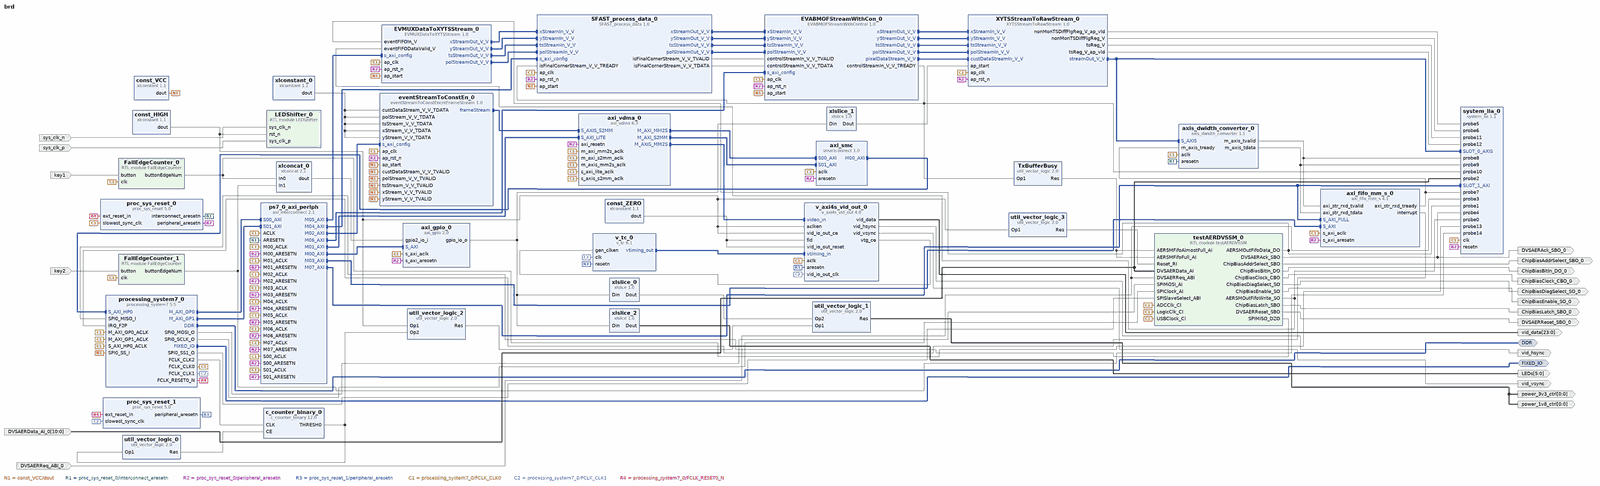
[diagram p0: block diagram of the top level, whole]
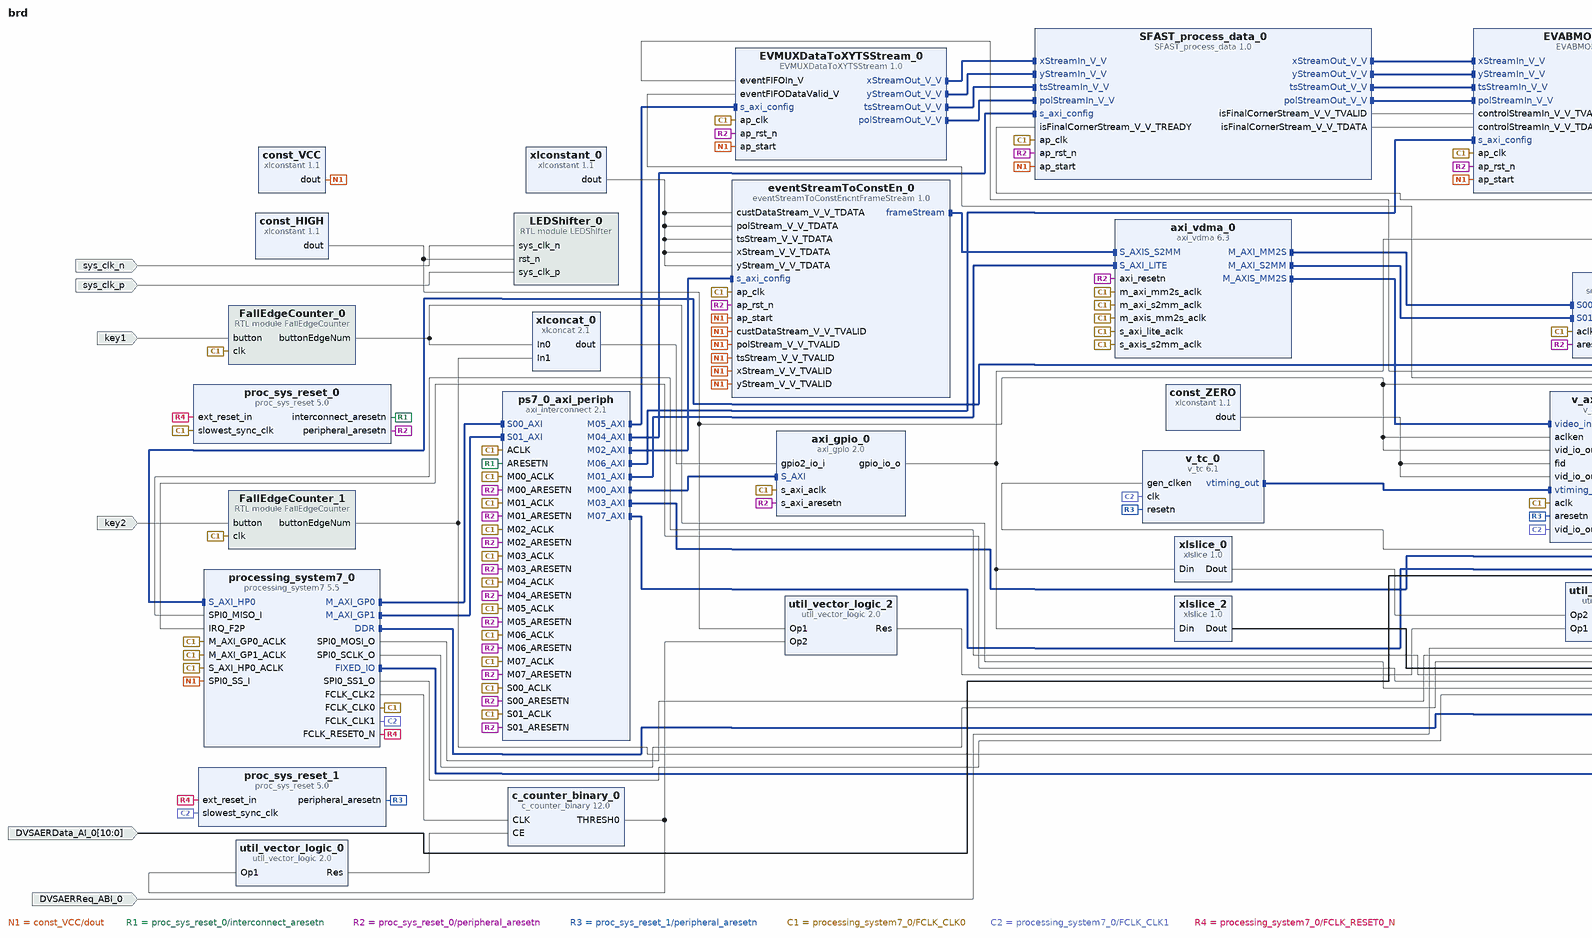
[diagram p1: block diagram of the top level, left part]
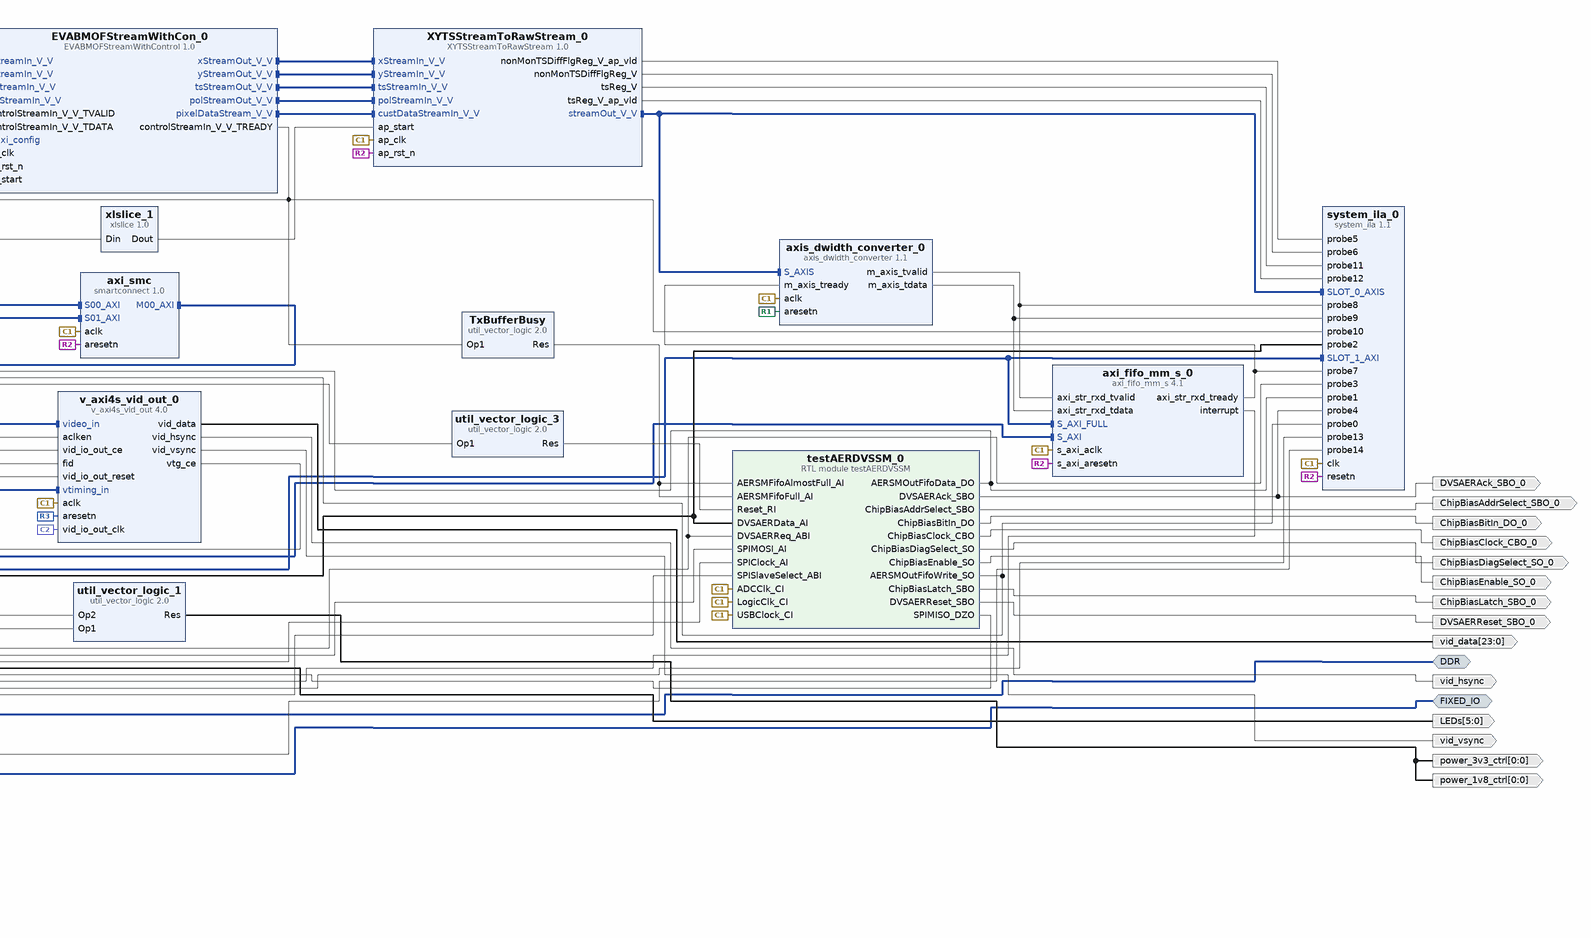
[diagram p2: block diagram of the top level, right part]
# Vivado block design brd, xc7z035ffg676-2, Vivado 2018.1
create_bd_design brd

create_bd_intf_port -mode Master -vlnv xilinx.com:interface:ddrx_rtl:1.0 DDR
create_bd_intf_port -mode Master -vlnv xilinx.com:display_processing_system7:fixedio_rtl:1.0 FIXED_IO
create_bd_port -dir I -from 10 -to 0 DVSAERData_AI_0
create_bd_port -dir I DVSAERReq_ABI_0
create_bd_port -dir O ChipBiasAddrSelect_SBO_0
create_bd_port -dir O ChipBiasBitIn_DO_0
create_bd_port -dir O ChipBiasClock_CBO_0
create_bd_port -dir O ChipBiasDiagSelect_SO_0
create_bd_port -dir O ChipBiasEnable_SO_0
create_bd_port -dir O ChipBiasLatch_SBO_0
create_bd_port -dir O DVSAERAck_SBO_0
create_bd_port -dir O DVSAERReset_SBO_0
create_bd_port -dir O -from 23 -to 0 vid_data
create_bd_port -dir O vid_hsync
create_bd_port -dir O vid_vsync
create_bd_port -dir I -type clk sys_clk_n
create_bd_port -dir I -type clk sys_clk_p
create_bd_port -dir O -from 5 -to 0 LEDs
create_bd_port -dir O -from 0 -to 0 power_3v3_ctrl
create_bd_port -dir O -from 0 -to 0 power_1v8_ctrl
create_bd_port -dir I key1
create_bd_port -dir I key2

create_bd_cell -type ip -vlnv xilinx.com:ip:axi_gpio:2.0 axi_gpio_0
set_property -dict [list \
  CONFIG.C_GPIO_WIDTH 32 \
  CONFIG.C_IS_DUAL 1 \
  CONFIG.C_DOUT_DEFAULT 0x0000000F \
  CONFIG.C_ALL_INPUTS_2 1 \
  CONFIG.C_INTERRUPT_PRESENT 0 \
  CONFIG.C_ALL_OUTPUTS 1 \
] [get_bd_cells axi_gpio_0]
create_bd_cell -type ip -vlnv xilinx.com:ip:smartconnect:1.0 axi_smc
set_property -dict {CONFIG.NUM_SI 2} [get_bd_cells axi_smc]
create_bd_cell -type ip -vlnv xilinx.com:ip:axi_vdma:6.3 axi_vdma_0
set_property -dict {CONFIG.c_m_axis_mm2s_tdata_width 24} [get_bd_cells axi_vdma_0]
create_bd_cell -type ip -vlnv xilinx.com:ip:xlconstant:1.1 const_HIGH
create_bd_cell -type ip -vlnv xilinx.com:ip:xlconstant:1.1 const_VCC
create_bd_cell -type ip -vlnv xilinx.com:ip:xlconstant:1.1 const_ZERO
set_property -dict {CONFIG.CONST_VAL 0} [get_bd_cells const_ZERO]
create_bd_cell -type ip -vlnv xilinx.com:ip:proc_sys_reset:5.0 proc_sys_reset_0
create_bd_cell -type ip -vlnv xilinx.com:ip:proc_sys_reset:5.0 proc_sys_reset_1
create_bd_cell -type ip -vlnv xilinx.com:ip:processing_system7:5.5 processing_system7_0
set_property -dict [list \
  CONFIG.PCW_FCLK_CLK1_BUF TRUE \
  CONFIG.PCW_FCLK_CLK2_BUF TRUE \
  CONFIG.PCW_FCLK_CLK3_BUF TRUE \
  CONFIG.PCW_UIPARAM_DDR_FREQ_MHZ 533.333333 \
  CONFIG.PCW_CPU_CPU_6X4X_MAX_RANGE 800 \
  CONFIG.PCW_CRYSTAL_PERIPHERAL_FREQMHZ 33.3333333 \
  CONFIG.PCW_APU_PERIPHERAL_FREQMHZ 666.666666 \
  CONFIG.PCW_UART_PERIPHERAL_FREQMHZ 100 \
  CONFIG.PCW_SPI_PERIPHERAL_FREQMHZ 125 \
  CONFIG.PCW_FPGA0_PERIPHERAL_FREQMHZ 100 \
  CONFIG.PCW_FPGA1_PERIPHERAL_FREQMHZ 40 \
  CONFIG.PCW_FPGA2_PERIPHERAL_FREQMHZ 10 \
  CONFIG.PCW_FPGA3_PERIPHERAL_FREQMHZ 125 \
  CONFIG.PCW_USE_M_AXI_GP1 1 \
  CONFIG.PCW_USE_S_AXI_HP0 1 \
  CONFIG.PCW_USE_FABRIC_INTERRUPT 1 \
  CONFIG.PCW_EN_CLK1_PORT 1 \
  CONFIG.PCW_EN_CLK2_PORT 1 \
  CONFIG.PCW_EN_CLK3_PORT 1 \
  CONFIG.PCW_IRQ_F2P_INTR 1 \
  CONFIG.PCW_PERIPHERAL_BOARD_PRESET None \
  CONFIG.PCW_PRESET_BANK1_VOLTAGE {LVCMOS 1.8V} \
  CONFIG.PCW_UIPARAM_DDR_PARTNO {MT41J256M16 RE-125} \
  CONFIG.PCW_QSPI_PERIPHERAL_ENABLE 1 \
  CONFIG.PCW_QSPI_QSPI_IO {MIO 1 .. 6} \
  CONFIG.PCW_QSPI_GRP_SINGLE_SS_ENABLE 0 \
  CONFIG.PCW_DUAL_PARALLEL_QSPI_DATA_MODE x8 \
  CONFIG.PCW_QSPI_GRP_IO1_ENABLE 1 \
  CONFIG.PCW_QSPI_GRP_IO1_IO {MIO 0 9 .. 13} \
  CONFIG.PCW_QSPI_GRP_FBCLK_ENABLE 1 \
  CONFIG.PCW_QSPI_GRP_FBCLK_IO {MIO 8} \
  CONFIG.PCW_QSPI_INTERNAL_HIGHADDRESS 0xFDFFFFFF \
  CONFIG.PCW_ENET0_PERIPHERAL_ENABLE 0 \
  CONFIG.PCW_SD0_PERIPHERAL_ENABLE 0 \
  CONFIG.PCW_UART0_PERIPHERAL_ENABLE 1 \
  CONFIG.PCW_UART0_UART0_IO {MIO 14 .. 15} \
  CONFIG.PCW_UART1_PERIPHERAL_ENABLE 0 \
  CONFIG.PCW_SPI0_PERIPHERAL_ENABLE 1 \
  CONFIG.PCW_SPI0_SPI0_IO EMIO \
  CONFIG.PCW_USB0_PERIPHERAL_ENABLE 1 \
  CONFIG.PCW_USB0_USB0_IO {MIO 28 .. 39} \
  CONFIG.PCW_GPIO_MIO_GPIO_ENABLE 0 \
  CONFIG.PCW_FPGA_FCLK1_ENABLE 1 \
  CONFIG.PCW_FPGA_FCLK2_ENABLE 1 \
  CONFIG.PCW_FPGA_FCLK3_ENABLE 1 \
] [get_bd_cells processing_system7_0]
# 417 more settings of processing_system7_0 are not shown: defaults, MIO pin electricals, DDR timing, and values the tool derives
create_bd_cell -type ip -vlnv xilinx.com:ip:axi_interconnect:2.1 ps7_0_axi_periph
set_property -dict {CONFIG.NUM_SI 2 CONFIG.NUM_MI 8} [get_bd_cells ps7_0_axi_periph]
create_bd_cell -type ip -vlnv xilinx.com:ip:system_ila:1.1 system_ila_0
set_property -dict [list \
  CONFIG.C_SLOT_6_TYPE 0 \
  CONFIG.C_SLOT_2_TYPE 0 \
  CONFIG.C_SLOT_1_TYPE 0 \
  CONFIG.C_SLOT_0_TYPE 0 \
  CONFIG.C_SLOT_0_APC_EN 0 \
  CONFIG.C_SLOT_1_APC_EN 0 \
  CONFIG.C_SLOT_2_APC_EN 0 \
  CONFIG.C_SLOT_3_APC_EN 0 \
  CONFIG.C_SLOT_4_APC_EN 0 \
  CONFIG.C_SLOT_5_APC_EN 0 \
  CONFIG.C_SLOT_6_APC_EN 0 \
  CONFIG.C_SLOT_7_APC_EN 0 \
  CONFIG.C_SLOT_2_AXI_AW_SEL_DATA 1 \
  CONFIG.C_SLOT_2_AXI_W_SEL_DATA 1 \
  CONFIG.C_SLOT_2_AXI_B_SEL_DATA 1 \
  CONFIG.C_SLOT_2_AXI_AR_SEL_DATA 1 \
  CONFIG.C_SLOT_2_AXI_R_SEL_DATA 1 \
  CONFIG.C_SLOT_2_AXI_AW_SEL_TRIG 1 \
  CONFIG.C_SLOT_2_AXI_W_SEL_TRIG 1 \
  CONFIG.C_SLOT_2_AXI_B_SEL_TRIG 1 \
  CONFIG.C_SLOT_2_AXI_AR_SEL_TRIG 1 \
  CONFIG.C_SLOT_2_AXI_R_SEL_TRIG 1 \
  CONFIG.C_SLOT_0_AXI_DATA_SEL 1 \
  CONFIG.C_SLOT_1_AXI_DATA_SEL 1 \
  CONFIG.C_SLOT_2_AXI_DATA_SEL 1 \
  CONFIG.C_SLOT_3_AXI_DATA_SEL 1 \
  CONFIG.C_SLOT_4_AXI_DATA_SEL 1 \
  CONFIG.C_SLOT_5_AXI_DATA_SEL 1 \
  CONFIG.C_SLOT_6_AXI_DATA_SEL 1 \
  CONFIG.C_SLOT_7_AXI_DATA_SEL 1 \
  CONFIG.C_SLOT_0_AXI_TRIG_SEL 1 \
  CONFIG.C_SLOT_1_AXI_TRIG_SEL 1 \
  CONFIG.C_SLOT_2_AXI_TRIG_SEL 1 \
  CONFIG.C_SLOT_3_AXI_TRIG_SEL 1 \
  CONFIG.C_SLOT_4_AXI_TRIG_SEL 1 \
  CONFIG.C_SLOT_5_AXI_TRIG_SEL 1 \
  CONFIG.C_SLOT_6_AXI_TRIG_SEL 1 \
  CONFIG.C_SLOT_7_AXI_TRIG_SEL 1 \
  CONFIG.C_PROBE22_TYPE 0 \
  CONFIG.C_PROBE21_TYPE 0 \
  CONFIG.C_PROBE20_TYPE 0 \
  CONFIG.C_PROBE19_TYPE 0 \
  CONFIG.C_PROBE18_TYPE 0 \
  CONFIG.C_PROBE17_TYPE 0 \
  CONFIG.C_PROBE16_TYPE 0 \
  CONFIG.C_PROBE15_TYPE 0 \
  CONFIG.C_PROBE14_TYPE 0 \
  CONFIG.C_PROBE13_TYPE 0 \
  CONFIG.C_PROBE12_TYPE 0 \
  CONFIG.C_PROBE11_TYPE 0 \
  CONFIG.C_PROBE10_TYPE 0 \
  CONFIG.C_PROBE9_TYPE 0 \
  CONFIG.C_PROBE8_TYPE 0 \
  CONFIG.C_PROBE7_TYPE 0 \
  CONFIG.C_PROBE6_TYPE 0 \
  CONFIG.C_PROBE5_TYPE 0 \
  CONFIG.C_PROBE4_TYPE 0 \
  CONFIG.C_PROBE3_TYPE 0 \
  CONFIG.C_PROBE2_TYPE 0 \
  CONFIG.C_PROBE1_TYPE 0 \
  CONFIG.C_PROBE0_TYPE 0 \
  CONFIG.C_DATA_DEPTH 16384 \
  CONFIG.C_NUM_OF_PROBES 15 \
  CONFIG.C_NUM_MONITOR_SLOTS 2 \
  CONFIG.C_SLOT_0_INTF_TYPE xilinx.com:interface:axis_rtl:1.0 \
  CONFIG.C_SLOT_1_INTF_TYPE xilinx.com:interface:aximm_rtl:1.0 \
  CONFIG.C_SLOT_2_INTF_TYPE xilinx.com:interface:aximm_rtl:1.0 \
  CONFIG.C_SLOT_3_INTF_TYPE xilinx.com:interface:axis_rtl:1.0 \
  CONFIG.C_SLOT_4_INTF_TYPE xilinx.com:interface:axis_rtl:1.0 \
  CONFIG.C_SLOT_5_INTF_TYPE xilinx.com:interface:axis_rtl:1.0 \
  CONFIG.C_SLOT_6_INTF_TYPE xilinx.com:interface:axis_rtl:1.0 \
  CONFIG.C_SLOT_7_INTF_TYPE xilinx.com:interface:axis_rtl:1.0 \
  CONFIG.C_MON_TYPE MIX \
] [get_bd_cells system_ila_0]
create_bd_cell -type ip -vlnv xilinx.com:ip:v_axi4s_vid_out:4.0 v_axi4s_vid_out_0
set_property -dict {CONFIG.C_HAS_ASYNC_CLK 1} [get_bd_cells v_axi4s_vid_out_0]
create_bd_cell -type ip -vlnv xilinx.com:ip:v_tc:6.1 v_tc_0
set_property -dict {CONFIG.HAS_AXI4_LITE false CONFIG.VIDEO_MODE 800x600p CONFIG.enable_detection false} [get_bd_cells v_tc_0]
create_bd_cell -type ip -vlnv xilinx.com:ip:xlslice:1.0 xlslice_0
set_property -dict {CONFIG.DIN_TO 0 CONFIG.DIN_FROM 0 CONFIG.DIN_WIDTH 4} [get_bd_cells xlslice_0]
create_bd_cell -type module -reference LEDShifter LEDShifter_0
create_bd_cell -type ip -vlnv xilinx.com:ip:c_counter_binary:12.0 c_counter_binary_0
set_property -dict {CONFIG.Sync_Threshold_Output true CONFIG.Threshold_Value 100 CONFIG.CE true} [get_bd_cells c_counter_binary_0]
create_bd_cell -type ip -vlnv xilinx.com:ip:util_vector_logic:2.0 util_vector_logic_0
set_property -dict {CONFIG.C_SIZE 1 CONFIG.C_OPERATION not} [get_bd_cells util_vector_logic_0]
create_bd_cell -type ip -vlnv xilinx.com:ip:util_vector_logic:2.0 util_vector_logic_1
set_property -dict {CONFIG.C_SIZE 1} [get_bd_cells util_vector_logic_1]
create_bd_cell -type ip -vlnv xilinx.com:ip:util_vector_logic:2.0 util_vector_logic_2
set_property -dict {CONFIG.C_SIZE 1} [get_bd_cells util_vector_logic_2]
create_bd_cell -type ip -vlnv xilinx.com:ip:util_vector_logic:2.0 util_vector_logic_3
set_property -dict {CONFIG.C_SIZE 1 CONFIG.C_OPERATION not} [get_bd_cells util_vector_logic_3]
create_bd_cell -type ip -vlnv xilinx.com:ip:xlconstant:1.1 xlconstant_0
set_property -dict {CONFIG.CONST_WIDTH 16 CONFIG.CONST_VAL 0x5a5a} [get_bd_cells xlconstant_0]
create_bd_cell -type ip -vlnv xilinx.com:ip:axi_fifo_mm_s:4.1 axi_fifo_mm_s_0
set_property -dict [list \
  CONFIG.C_DATA_INTERFACE_TYPE 1 \
  CONFIG.C_RX_FIFO_PE_THRESHOLD 2 \
  CONFIG.C_RX_FIFO_PF_THRESHOLD 16000 \
  CONFIG.C_RX_FIFO_DEPTH 16384 \
  CONFIG.C_USE_RX_CUT_THROUGH true \
  CONFIG.C_USE_TX_DATA 0 \
  CONFIG.C_USE_RX_DATA 1 \
  CONFIG.C_USE_TX_CTRL 0 \
] [get_bd_cells axi_fifo_mm_s_0]
create_bd_cell -type ip -vlnv xilinx.com:ip:axis_dwidth_converter:1.1 axis_dwidth_converter_0
set_property -dict {CONFIG.M_TDATA_NUM_BYTES 4} [get_bd_cells axis_dwidth_converter_0]
create_bd_cell -type module -reference testAERDVSSM testAERDVSSM_0
create_bd_cell -type ip -vlnv xilinx.com:ip:xlslice:1.0 xlslice_1
set_property -dict {CONFIG.DIN_TO 1 CONFIG.DIN_FROM 1 CONFIG.DIN_WIDTH 4 CONFIG.DOUT_WIDTH 1} [get_bd_cells xlslice_1]
create_bd_cell -type ip -vlnv xilinx.com:ip:util_vector_logic:2.0 TxBufferBusy
set_property -dict {CONFIG.C_SIZE 1 CONFIG.C_OPERATION not} [get_bd_cells TxBufferBusy]
create_bd_cell -type ip -vlnv xilinx.com:hls:EVABMOFStreamWithControl:1.0 EVABMOFStreamWithCon_0
create_bd_cell -type ip -vlnv xilinx.com:hls:EVMUXDataToXYTSStream:1.0 EVMUXDataToXYTSStream_0
create_bd_cell -type ip -vlnv xilinx.com:hls:SFAST_process_data:1.0 SFAST_process_data_0
create_bd_cell -type ip -vlnv xilinx.com:hls:eventStreamToConstEncntFrameStream:1.0 eventStreamToConstEn_0
create_bd_cell -type ip -vlnv xilinx.com:hls:XYTSStreamToRawStream:1.0 XYTSStreamToRawStream_0
create_bd_cell -type module -reference FallEdgeCounter FallEdgeCounter_0
create_bd_cell -type module -reference FallEdgeCounter FallEdgeCounter_1
create_bd_cell -type ip -vlnv xilinx.com:ip:xlconcat:2.1 xlconcat_0
create_bd_cell -type ip -vlnv xilinx.com:ip:xlslice:1.0 xlslice_2
set_property -dict {CONFIG.DIN_TO 16 CONFIG.DIN_FROM 21 CONFIG.DIN_WIDTH 32 CONFIG.DOUT_WIDTH 1} [get_bd_cells xlslice_2]

# ---- connections ----

connect_bd_intf_net [get_bd_intf_pins processing_system7_0/M_AXI_GP0] [get_bd_intf_pins ps7_0_axi_periph/S00_AXI]
connect_bd_intf_net [get_bd_intf_pins ps7_0_axi_periph/M00_AXI] [get_bd_intf_pins axi_gpio_0/S_AXI]
connect_bd_intf_net [get_bd_intf_pins ps7_0_axi_periph/M01_AXI] [get_bd_intf_pins axi_vdma_0/S_AXI_LITE]
connect_bd_intf_net [get_bd_intf_pins v_axi4s_vid_out_0/vtiming_in] [get_bd_intf_pins v_tc_0/vtiming_out]
connect_bd_intf_net [get_bd_intf_pins axi_vdma_0/S_AXIS_S2MM] [get_bd_intf_pins eventStreamToConstEn_0/frameStream]
connect_bd_intf_net [get_bd_intf_pins axi_vdma_0/M_AXI_MM2S] [get_bd_intf_pins axi_smc/S00_AXI]
connect_bd_intf_net [get_bd_intf_pins axi_smc/M00_AXI] [get_bd_intf_pins processing_system7_0/S_AXI_HP0]
connect_bd_intf_net [get_bd_intf_pins axi_vdma_0/M_AXI_S2MM] [get_bd_intf_pins axi_smc/S01_AXI]
connect_bd_intf_net [get_bd_intf_pins ps7_0_axi_periph/M02_AXI] [get_bd_intf_pins eventStreamToConstEn_0/s_axi_config]
connect_bd_intf_net [get_bd_intf_pins ps7_0_axi_periph/M05_AXI] [get_bd_intf_pins EVMUXDataToXYTSStream_0/s_axi_config]
connect_bd_intf_net [get_bd_intf_pins axi_vdma_0/M_AXIS_MM2S] [get_bd_intf_pins v_axi4s_vid_out_0/video_in]
connect_bd_intf_net [get_bd_intf_pins ps7_0_axi_periph/M04_AXI] [get_bd_intf_pins SFAST_process_data_0/s_axi_config]
connect_bd_intf_net [get_bd_intf_pins EVMUXDataToXYTSStream_0/xStreamOut_V_V] [get_bd_intf_pins SFAST_process_data_0/xStreamIn_V_V]
connect_bd_intf_net [get_bd_intf_pins EVMUXDataToXYTSStream_0/yStreamOut_V_V] [get_bd_intf_pins SFAST_process_data_0/yStreamIn_V_V]
connect_bd_intf_net [get_bd_intf_pins EVMUXDataToXYTSStream_0/tsStreamOut_V_V] [get_bd_intf_pins SFAST_process_data_0/tsStreamIn_V_V]
connect_bd_intf_net [get_bd_intf_pins EVMUXDataToXYTSStream_0/polStreamOut_V_V] [get_bd_intf_pins SFAST_process_data_0/polStreamIn_V_V]
connect_bd_intf_net [get_bd_intf_pins processing_system7_0/M_AXI_GP1] [get_bd_intf_pins ps7_0_axi_periph/S01_AXI]
connect_bd_intf_net [get_bd_intf_pins ps7_0_axi_periph/M06_AXI] [get_bd_intf_pins EVABMOFStreamWithCon_0/s_axi_config]
connect_bd_intf_net [get_bd_intf_pins SFAST_process_data_0/xStreamOut_V_V] [get_bd_intf_pins EVABMOFStreamWithCon_0/xStreamIn_V_V]
connect_bd_intf_net [get_bd_intf_pins SFAST_process_data_0/yStreamOut_V_V] [get_bd_intf_pins EVABMOFStreamWithCon_0/yStreamIn_V_V]
connect_bd_intf_net [get_bd_intf_pins SFAST_process_data_0/tsStreamOut_V_V] [get_bd_intf_pins EVABMOFStreamWithCon_0/tsStreamIn_V_V]
connect_bd_intf_net [get_bd_intf_pins SFAST_process_data_0/polStreamOut_V_V] [get_bd_intf_pins EVABMOFStreamWithCon_0/polStreamIn_V_V]
connect_bd_intf_net [get_bd_intf_pins EVABMOFStreamWithCon_0/xStreamOut_V_V] [get_bd_intf_pins XYTSStreamToRawStream_0/xStreamIn_V_V]
connect_bd_intf_net [get_bd_intf_pins EVABMOFStreamWithCon_0/yStreamOut_V_V] [get_bd_intf_pins XYTSStreamToRawStream_0/yStreamIn_V_V]
connect_bd_intf_net [get_bd_intf_pins EVABMOFStreamWithCon_0/tsStreamOut_V_V] [get_bd_intf_pins XYTSStreamToRawStream_0/tsStreamIn_V_V]
connect_bd_intf_net [get_bd_intf_pins EVABMOFStreamWithCon_0/polStreamOut_V_V] [get_bd_intf_pins XYTSStreamToRawStream_0/polStreamIn_V_V]
connect_bd_intf_net [get_bd_intf_pins EVABMOFStreamWithCon_0/pixelDataStream_V_V] [get_bd_intf_pins XYTSStreamToRawStream_0/custDataStreamIn_V_V]
connect_bd_intf_net [get_bd_intf_pins XYTSStreamToRawStream_0/streamOut_V_V] [get_bd_intf_pins axis_dwidth_converter_0/S_AXIS]
connect_bd_intf_net [get_bd_intf_pins XYTSStreamToRawStream_0/streamOut_V_V] [get_bd_intf_pins system_ila_0/SLOT_0_AXIS]
connect_bd_intf_net [get_bd_intf_pins ps7_0_axi_periph/M03_AXI] [get_bd_intf_pins axi_fifo_mm_s_0/S_AXI]
connect_bd_intf_net [get_bd_intf_pins ps7_0_axi_periph/M07_AXI] [get_bd_intf_pins axi_fifo_mm_s_0/S_AXI_FULL]
connect_bd_intf_net [get_bd_intf_pins ps7_0_axi_periph/M07_AXI] [get_bd_intf_pins system_ila_0/SLOT_1_AXI]
connect_bd_intf_net [get_bd_intf_ports DDR] [get_bd_intf_pins processing_system7_0/DDR]
connect_bd_intf_net [get_bd_intf_ports FIXED_IO] [get_bd_intf_pins processing_system7_0/FIXED_IO]
connect_bd_net -net DVSAERData_AI_0_1 [get_bd_ports DVSAERData_AI_0] [get_bd_pins testAERDVSSM_0/DVSAERData_AI] [get_bd_pins system_ila_0/probe2]
connect_bd_net -net DVSAERReq_ABI_0_1 [get_bd_ports DVSAERReq_ABI_0] [get_bd_pins testAERDVSSM_0/DVSAERReq_ABI] [get_bd_pins system_ila_0/probe3]
connect_bd_net [get_bd_pins const_HIGH/dout] \
  [get_bd_pins v_axi4s_vid_out_0/aclken] [get_bd_pins v_axi4s_vid_out_0/vid_io_out_ce] [get_bd_pins LEDShifter_0/rst_n] \
  [get_bd_pins util_vector_logic_2/Op1] [get_bd_pins util_vector_logic_3/Op1]
connect_bd_net [get_bd_pins axi_gpio_0/gpio_io_o] [get_bd_pins xlslice_0/Din] [get_bd_pins xlslice_1/Din] [get_bd_pins xlslice_2/Din]
connect_bd_net [get_bd_pins const_VCC/dout] \
  [get_bd_pins processing_system7_0/SPI0_SS_I] [get_bd_pins EVABMOFStreamWithCon_0/ap_start] \
  [get_bd_pins EVMUXDataToXYTSStream_0/ap_start] [get_bd_pins SFAST_process_data_0/ap_start] \
  [get_bd_pins eventStreamToConstEn_0/ap_start] [get_bd_pins eventStreamToConstEn_0/xStream_V_V_TVALID] \
  [get_bd_pins eventStreamToConstEn_0/yStream_V_V_TVALID] [get_bd_pins eventStreamToConstEn_0/polStream_V_V_TVALID] \
  [get_bd_pins eventStreamToConstEn_0/tsStream_V_V_TVALID] [get_bd_pins eventStreamToConstEn_0/custDataStream_V_V_TVALID]
connect_bd_net [get_bd_pins proc_sys_reset_0/interconnect_aresetn] \
  [get_bd_pins axis_dwidth_converter_0/aresetn] [get_bd_pins ps7_0_axi_periph/ARESETN]
connect_bd_net [get_bd_pins proc_sys_reset_0/peripheral_aresetn] \
  [get_bd_pins axi_gpio_0/s_axi_aresetn] [get_bd_pins axi_smc/aresetn] [get_bd_pins axi_vdma_0/axi_resetn] \
  [get_bd_pins system_ila_0/resetn] [get_bd_pins axi_fifo_mm_s_0/s_axi_aresetn] [get_bd_pins EVABMOFStreamWithCon_0/ap_rst_n] \
  [get_bd_pins EVMUXDataToXYTSStream_0/ap_rst_n] [get_bd_pins SFAST_process_data_0/ap_rst_n] \
  [get_bd_pins eventStreamToConstEn_0/ap_rst_n] [get_bd_pins XYTSStreamToRawStream_0/ap_rst_n] \
  [get_bd_pins ps7_0_axi_periph/S00_ARESETN] [get_bd_pins ps7_0_axi_periph/M00_ARESETN] \
  [get_bd_pins ps7_0_axi_periph/M01_ARESETN] [get_bd_pins ps7_0_axi_periph/M02_ARESETN] \
  [get_bd_pins ps7_0_axi_periph/M03_ARESETN] [get_bd_pins ps7_0_axi_periph/M04_ARESETN] \
  [get_bd_pins ps7_0_axi_periph/M05_ARESETN] [get_bd_pins ps7_0_axi_periph/S01_ARESETN] \
  [get_bd_pins ps7_0_axi_periph/M06_ARESETN] [get_bd_pins ps7_0_axi_periph/M07_ARESETN]
connect_bd_net [get_bd_pins proc_sys_reset_1/peripheral_aresetn] [get_bd_pins v_axi4s_vid_out_0/aresetn] [get_bd_pins v_tc_0/resetn]
connect_bd_net [get_bd_pins processing_system7_0/FCLK_CLK0] \
  [get_bd_pins axi_gpio_0/s_axi_aclk] [get_bd_pins axi_smc/aclk] [get_bd_pins axi_vdma_0/s_axi_lite_aclk] \
  [get_bd_pins axi_vdma_0/m_axi_mm2s_aclk] [get_bd_pins axi_vdma_0/m_axis_mm2s_aclk] [get_bd_pins axi_vdma_0/m_axi_s2mm_aclk] \
  [get_bd_pins axi_vdma_0/s_axis_s2mm_aclk] [get_bd_pins proc_sys_reset_0/slowest_sync_clk] \
  [get_bd_pins processing_system7_0/M_AXI_GP0_ACLK] [get_bd_pins processing_system7_0/S_AXI_HP0_ACLK] \
  [get_bd_pins system_ila_0/clk] [get_bd_pins v_axi4s_vid_out_0/aclk] [get_bd_pins axi_fifo_mm_s_0/s_axi_aclk] \
  [get_bd_pins axis_dwidth_converter_0/aclk] [get_bd_pins processing_system7_0/M_AXI_GP1_ACLK] \
  [get_bd_pins testAERDVSSM_0/USBClock_CI] [get_bd_pins testAERDVSSM_0/LogicClk_CI] [get_bd_pins testAERDVSSM_0/ADCClk_CI] \
  [get_bd_pins EVABMOFStreamWithCon_0/ap_clk] [get_bd_pins EVMUXDataToXYTSStream_0/ap_clk] \
  [get_bd_pins SFAST_process_data_0/ap_clk] [get_bd_pins eventStreamToConstEn_0/ap_clk] \
  [get_bd_pins XYTSStreamToRawStream_0/ap_clk] [get_bd_pins ps7_0_axi_periph/ACLK] [get_bd_pins ps7_0_axi_periph/S00_ACLK] \
  [get_bd_pins ps7_0_axi_periph/M00_ACLK] [get_bd_pins ps7_0_axi_periph/M01_ACLK] [get_bd_pins ps7_0_axi_periph/M02_ACLK] \
  [get_bd_pins ps7_0_axi_periph/M03_ACLK] [get_bd_pins ps7_0_axi_periph/M04_ACLK] [get_bd_pins ps7_0_axi_periph/M05_ACLK] \
  [get_bd_pins ps7_0_axi_periph/S01_ACLK] [get_bd_pins ps7_0_axi_periph/M06_ACLK] [get_bd_pins ps7_0_axi_periph/M07_ACLK] \
  [get_bd_pins FallEdgeCounter_0/clk] [get_bd_pins FallEdgeCounter_1/clk]
connect_bd_net [get_bd_pins processing_system7_0/FCLK_CLK1] \
  [get_bd_pins proc_sys_reset_1/slowest_sync_clk] [get_bd_pins v_axi4s_vid_out_0/vid_io_out_clk] [get_bd_pins v_tc_0/clk]
connect_bd_net [get_bd_pins processing_system7_0/FCLK_RESET0_N] \
  [get_bd_pins proc_sys_reset_0/ext_reset_in] [get_bd_pins proc_sys_reset_1/ext_reset_in]
connect_bd_net [get_bd_pins testAERDVSSM_0/AERSMOutFifoData_DO] [get_bd_pins EVMUXDataToXYTSStream_0/eventFIFOIn_V] [get_bd_pins system_ila_0/probe1]
connect_bd_net [get_bd_pins testAERDVSSM_0/AERSMOutFifoWrite_SO] \
  [get_bd_pins EVMUXDataToXYTSStream_0/eventFIFODataValid_V] [get_bd_pins system_ila_0/probe0]
connect_bd_net [get_bd_pins testAERDVSSM_0/ChipBiasAddrSelect_SBO] [get_bd_ports ChipBiasAddrSelect_SBO_0]
connect_bd_net [get_bd_pins testAERDVSSM_0/ChipBiasBitIn_DO] [get_bd_ports ChipBiasBitIn_DO_0]
connect_bd_net [get_bd_pins testAERDVSSM_0/ChipBiasClock_CBO] [get_bd_ports ChipBiasClock_CBO_0]
connect_bd_net [get_bd_pins testAERDVSSM_0/ChipBiasDiagSelect_SO] [get_bd_ports ChipBiasDiagSelect_SO_0]
connect_bd_net [get_bd_pins testAERDVSSM_0/ChipBiasEnable_SO] [get_bd_ports ChipBiasEnable_SO_0]
connect_bd_net [get_bd_pins testAERDVSSM_0/ChipBiasLatch_SBO] [get_bd_ports ChipBiasLatch_SBO_0]
connect_bd_net [get_bd_pins testAERDVSSM_0/DVSAERAck_SBO] [get_bd_ports DVSAERAck_SBO_0] [get_bd_pins system_ila_0/probe4]
connect_bd_net [get_bd_pins testAERDVSSM_0/DVSAERReset_SBO] [get_bd_ports DVSAERReset_SBO_0]
connect_bd_net [get_bd_pins v_axi4s_vid_out_0/vid_data] [get_bd_ports vid_data]
connect_bd_net [get_bd_pins v_axi4s_vid_out_0/vid_hsync] [get_bd_ports vid_hsync]
connect_bd_net [get_bd_pins v_axi4s_vid_out_0/vid_vsync] [get_bd_ports vid_vsync]
connect_bd_net [get_bd_pins v_axi4s_vid_out_0/vtg_ce] [get_bd_pins v_tc_0/gen_clken]
connect_bd_net [get_bd_pins xlslice_0/Dout] [get_bd_pins util_vector_logic_1/Op2]
connect_bd_net [get_bd_pins const_ZERO/dout] [get_bd_pins v_axi4s_vid_out_0/fid] [get_bd_pins v_axi4s_vid_out_0/vid_io_out_reset]
connect_bd_net [get_bd_pins processing_system7_0/SPI0_MOSI_O] [get_bd_pins testAERDVSSM_0/SPIMOSI_AI]
connect_bd_net [get_bd_pins testAERDVSSM_0/SPIMISO_DZO] [get_bd_pins processing_system7_0/SPI0_MISO_I]
connect_bd_net [get_bd_pins processing_system7_0/SPI0_SCLK_O] [get_bd_pins testAERDVSSM_0/SPIClock_AI]
connect_bd_net [get_bd_pins processing_system7_0/SPI0_SS1_O] [get_bd_pins testAERDVSSM_0/SPISlaveSelect_ABI]
connect_bd_net -net sys_clk_n_0_1 [get_bd_ports sys_clk_n] [get_bd_pins LEDShifter_0/sys_clk_n]
connect_bd_net -net sys_clk_p_0_1 [get_bd_ports sys_clk_p] [get_bd_pins LEDShifter_0/sys_clk_p]
connect_bd_net [get_bd_pins processing_system7_0/FCLK_CLK2] [get_bd_pins c_counter_binary_0/CLK]
connect_bd_net [get_bd_pins util_vector_logic_0/Res] [get_bd_pins c_counter_binary_0/CE]
connect_bd_net [get_bd_pins c_counter_binary_0/THRESH0] [get_bd_pins util_vector_logic_0/Op1] [get_bd_pins util_vector_logic_2/Op2]
connect_bd_net [get_bd_pins util_vector_logic_2/Res] [get_bd_pins util_vector_logic_1/Op1]
connect_bd_net [get_bd_pins util_vector_logic_1/Res] [get_bd_ports power_1v8_ctrl] [get_bd_ports power_3v3_ctrl]
connect_bd_net [get_bd_pins util_vector_logic_3/Res] [get_bd_pins testAERDVSSM_0/Reset_RI]
connect_bd_net [get_bd_pins xlconstant_0/dout] \
  [get_bd_pins eventStreamToConstEn_0/xStream_V_V_TDATA] [get_bd_pins eventStreamToConstEn_0/yStream_V_V_TDATA] \
  [get_bd_pins eventStreamToConstEn_0/polStream_V_V_TDATA] [get_bd_pins eventStreamToConstEn_0/tsStream_V_V_TDATA] \
  [get_bd_pins eventStreamToConstEn_0/custDataStream_V_V_TDATA]
connect_bd_net [get_bd_pins axi_fifo_mm_s_0/interrupt] [get_bd_pins processing_system7_0/IRQ_F2P]
connect_bd_net [get_bd_pins xlslice_1/Dout] [get_bd_pins XYTSStreamToRawStream_0/ap_start]
connect_bd_net -net nonMonTSDiffFlgReg_V_ap_vld [get_bd_pins XYTSStreamToRawStream_0/nonMonTSDiffFlgReg_V_ap_vld] [get_bd_pins system_ila_0/probe5]
connect_bd_net -net nonMonTSDiffFlgReg_V [get_bd_pins XYTSStreamToRawStream_0/nonMonTSDiffFlgReg_V] [get_bd_pins system_ila_0/probe6]
connect_bd_net [get_bd_pins axi_fifo_mm_s_0/axi_str_rxd_tready] [get_bd_pins axis_dwidth_converter_0/m_axis_tready] [get_bd_pins system_ila_0/probe7]
connect_bd_net [get_bd_pins axis_dwidth_converter_0/m_axis_tvalid] [get_bd_pins axi_fifo_mm_s_0/axi_str_rxd_tvalid] [get_bd_pins system_ila_0/probe8]
connect_bd_net [get_bd_pins axis_dwidth_converter_0/m_axis_tdata] [get_bd_pins axi_fifo_mm_s_0/axi_str_rxd_tdata] [get_bd_pins system_ila_0/probe9]
connect_bd_net [get_bd_pins TxBufferBusy/Res] [get_bd_pins testAERDVSSM_0/AERSMFifoAlmostFull_AI] [get_bd_pins testAERDVSSM_0/AERSMFifoFull_AI]
connect_bd_net [get_bd_pins SFAST_process_data_0/isFinalCornerStream_V_V_TVALID] [get_bd_pins EVABMOFStreamWithCon_0/controlStreamIn_V_V_TVALID]
connect_bd_net [get_bd_pins EVABMOFStreamWithCon_0/controlStreamIn_V_V_TREADY] \
  [get_bd_pins SFAST_process_data_0/isFinalCornerStream_V_V_TREADY] [get_bd_pins TxBufferBusy/Op1] \
  [get_bd_pins system_ila_0/probe10]
connect_bd_net [get_bd_pins SFAST_process_data_0/isFinalCornerStream_V_V_TDATA] [get_bd_pins EVABMOFStreamWithCon_0/controlStreamIn_V_V_TDATA]
connect_bd_net -net tsReg_V [get_bd_pins XYTSStreamToRawStream_0/tsReg_V] [get_bd_pins system_ila_0/probe11]
connect_bd_net -net tsReg_V_ap_vld [get_bd_pins XYTSStreamToRawStream_0/tsReg_V_ap_vld] [get_bd_pins system_ila_0/probe12]
connect_bd_net -net button_0_1 [get_bd_ports key1] [get_bd_pins FallEdgeCounter_0/button]
connect_bd_net -net button_1_1 [get_bd_ports key2] [get_bd_pins FallEdgeCounter_1/button]
connect_bd_net [get_bd_pins xlconcat_0/dout] [get_bd_pins axi_gpio_0/gpio2_io_i]
connect_bd_net [get_bd_pins FallEdgeCounter_0/buttonEdgeNum] [get_bd_pins xlconcat_0/In0] [get_bd_pins system_ila_0/probe13]
connect_bd_net [get_bd_pins FallEdgeCounter_1/buttonEdgeNum] [get_bd_pins xlconcat_0/In1] [get_bd_pins system_ila_0/probe14]
connect_bd_net [get_bd_pins xlslice_2/Dout] [get_bd_ports LEDs]

# ---- address map ----
assign_bd_address -offset 0x00000000 -range 512M -target_address_space [get_bd_addr_spaces axi_vdma_0/Data_MM2S] [get_bd_addr_segs processing_system7_0/S_AXI_HP0/HP0_DDR_LOWOCM]
assign_bd_address -offset 0x00000000 -range 512M -target_address_space [get_bd_addr_spaces axi_vdma_0/Data_S2MM] [get_bd_addr_segs processing_system7_0/S_AXI_HP0/HP0_DDR_LOWOCM]
assign_bd_address -offset 0x40000000 -range 64K -target_address_space [get_bd_addr_spaces processing_system7_0/Data] [get_bd_addr_segs EVABMOFStreamWithCon_0/s_axi_config/Reg]
assign_bd_address -offset 0x40020000 -range 64K -target_address_space [get_bd_addr_spaces processing_system7_0/Data] [get_bd_addr_segs eventStreamToConstEn_0/s_axi_config/Reg]
assign_bd_address -offset 0x41200000 -range 64K -target_address_space [get_bd_addr_spaces processing_system7_0/Data] [get_bd_addr_segs axi_gpio_0/S_AXI/Reg]
assign_bd_address -offset 0x43000000 -range 64K -target_address_space [get_bd_addr_spaces processing_system7_0/Data] [get_bd_addr_segs axi_vdma_0/S_AXI_LITE/Reg]
assign_bd_address -offset 0x43C00000 -range 64K -target_address_space [get_bd_addr_spaces processing_system7_0/Data] [get_bd_addr_segs axi_fifo_mm_s_0/S_AXI/Mem0]
assign_bd_address -offset 0x43C10000 -range 64K -target_address_space [get_bd_addr_spaces processing_system7_0/Data] [get_bd_addr_segs axi_fifo_mm_s_0/S_AXI_FULL/Mem1]
assign_bd_address -offset 0x43C20000 -range 64K -target_address_space [get_bd_addr_spaces processing_system7_0/Data] [get_bd_addr_segs SFAST_process_data_0/s_axi_config/Reg]
assign_bd_address -offset 0x43C30000 -range 64K -target_address_space [get_bd_addr_spaces processing_system7_0/Data] [get_bd_addr_segs EVMUXDataToXYTSStream_0/s_axi_config/Reg]

validate_bd_design
save_bd_design
